# Altium project gui.PrjPcb
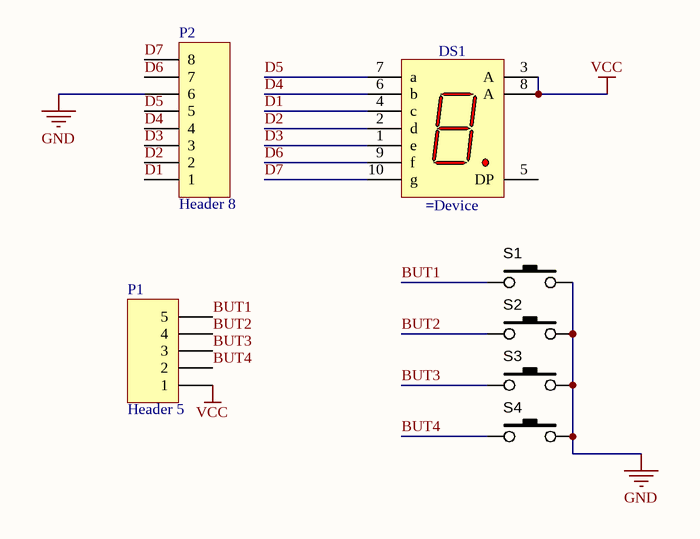
[diagram p0: gui.SchDoc]
1 sheet, 7 parts. Net scope: global (net labels, ports and power ports of the same name join across sheets).
Board file: gui.PcbDoc

## Sheet gui.SchDoc
size A

### Parts
DS1  (no value)  [PCBComponent_1]
P1  Header 5  [HDR1X5]
P2  Header 8  [HDR1X8]
S1  SW_THT_PB_7.0mm  [TACT-SWITCH-TS1170]  (value not drawn)
S2  SW_THT_PB_7.0mm  [TACT-SWITCH-TS1170]  (value not drawn)
S3  SW_THT_PB_7.0mm  [TACT-SWITCH-TS1170]  (value not drawn)
S4  SW_THT_PB_7.0mm  [TACT-SWITCH-TS1170]  (value not drawn)

### Nets
GND: P2.6 S1.2 S2.2 S3.2 S4.2
VCC: DS1.3(A) DS1.8(A) P1.1
BUT1: P1.5 S1.1
BUT2: P1.4 S2.1
BUT3: P1.3 S3.1
BUT4: P1.2 S4.1
D1: DS1.4(c) P2.1
D2: DS1.2(d) P2.2
D3: DS1.1(e) P2.3
D4: DS1.6(b) P2.4
D5: DS1.7(a) P2.5
D6: DS1.9(f) P2.7
D7: DS1.10(g) P2.8

Not connected (* = marked no-connect by the designer): DS1 5(DP)

### Library data of the parts
DS1 = 7-Segment Red Display CA Type1: 7-Segment Red Display Common Anode
P1 = Header 5: Header, 5-Pin; LatestRevisionDate: 17-Jul-2002; LatestRevisionNote: Re-released for DXP Platform.; Publisher: Altium Limited
P2 = Header 8: Header, 8-Pin; LatestRevisionDate: 17-Jul-2002; LatestRevisionNote: Re-released for DXP Platform.; Publisher: Altium Limited
S1-S4 = SW_THT_PB_7.0mm: Switch, tact, 7.0mm stem; Manufacturer 1: Bond-Tact; Manufacturer Part Number 1: TS-1170-WP-300; SCDType: source*; Function: On/Off; Package / Case: 6.5x6.5mm; 7.0mm stem; Material: Brass/Nylon/Ag plating